# EAGLE design sideways (EAGLE 9.6.1)
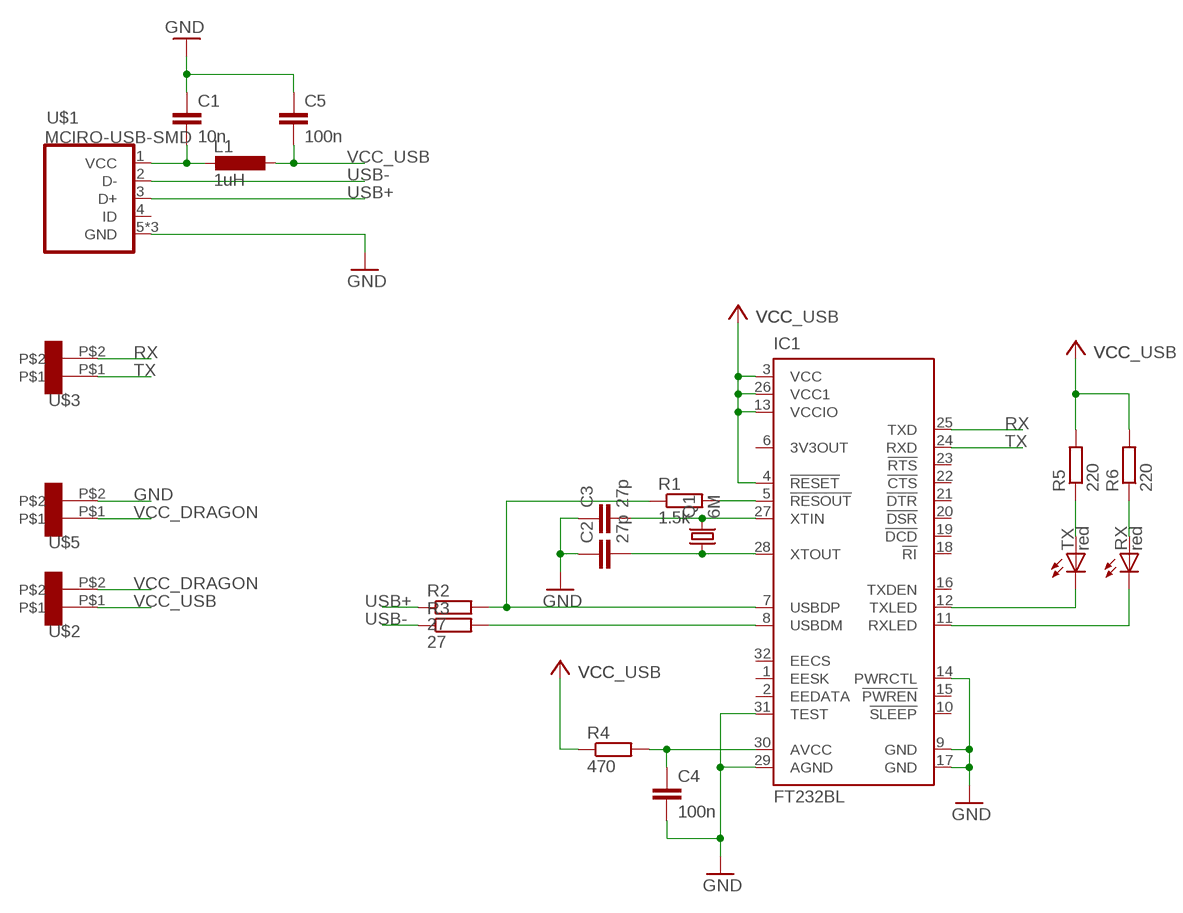
[diagram p0: schematic, sheet 1]

## Parts
C1  10n  C-EUC0603  [C0603]
C2  27p  C-EUC0603  [C0603]
C3  27p  C-EUC0603  [C0603]
C4  100n  C-EUC0603  [C0603]
C5  100n  C-EUC0603  [C0603]
IC1  FT232BL  [LQFP32-7X7]
L1  1uH  L-EUL0603  [L0603]
Q1  6M  CRYSTALHC49U-V  [HC49U-V]
R1  1.5k  R-EU_R0603  [R0603]
R2  27  R-EU_R0603  [R0603]
R3  27  R-EU_R0603  [R0603]
R4  470  R-EU_R0603  [R0603]
R5  220  R-EU_R0603  [R0603]
R6  220  R-EU_R0603  [R0603]
RX  red  LED_0603  [C0603]
TX  red  LED_0603  [C0603]
U$1  MCIRO-USB-SMD  [MICRO-USB-3]
U$2  CON_DIL_2  [CON_DIL_2]
U$3  CON_DIL_2  [CON_DIL_2]
U$5  CON_DIL_2  [CON_DIL_2]

## Nets
GND: C1.1 C2.1 C3.1 C4.2 C5.1 IC1.9(GND) IC1.14(PWRCTL) IC1.17(GND) IC1.29(AGND) IC1.31(TEST) U$1.5(GND) U$1.GND0(GND) U$1.GND1(GND) U$5.P$2
N$1: IC1.5(!RESOUT) R1.2
N$2: IC1.7(USBDP) R1.1 R2.2
N$3: IC1.8(USBDM) R3.2
N$4: C1.2 L1.2 U$1.1(VCC)
N$6: C3.2 IC1.27(XTIN) Q1.2
N$7: C2.2 IC1.28(XTOUT) Q1.1
N$9: IC1.12(TXLED) TX.N
N$10: R5.1 TX.P
N$11: C4.1 IC1.30(AVCC) R4.2
N$12: R6.1 RX.P
N$13: IC1.11(RXLED) RX.N
RX: IC1.25(TXD) U$3.P$2
TX: IC1.24(RXD) U$3.P$1
USB+: R2.1 U$1.3(D+)
USB-: R3.1 U$1.2(D-)
VCC_DRAGON: U$2.P$2 U$5.P$1
VCC_USB: C5.2 IC1.3(VCC) IC1.4(!RESET) IC1.13(VCCIO) IC1.26(VCC1) L1.1 R4.1 R5.2 R6.2 U$2.P$1 ; supply symbol labelled VCC
Unconnected: IC1.1(EESK) IC1.2(EEDATA) IC1.6(3V3OUT) IC1.10(!SLEEP) IC1.15(!PWREN) IC1.16(TXDEN) IC1.18(!RI) IC1.19(!DCD) IC1.20(!DSR) IC1.21(!DTR) IC1.22(!CTS) IC1.23(!RTS) IC1.32(EECS) U$1.4(ID)

## Library data of the parts
C1-C5 = rcl:C-EU: CAPACITOR, European symbol; SPICEPREFIX: C
IC1 = ftdichip:FT232B: USB to serial UART interface Source: DS_FT232BL_BQ.pdf; MF: FARNELL; MPN: FT232BL/TR; OC_FARNELL: unknown; OC_NEWARK: 38K1551
L1 = rcl-2:L-EU: INDUCTOR, European symbol
Q1 = crystal:CRYSTAL: CRYSTAL; OC_FARNELL: 1666969; OC_NEWARK: unknown
R1-R6 = rcl:R-EU_: RESISTOR, European symbol; SPICEPREFIX: R
RX TX = led:LED_0603
U$1 = microusb:MCIRO-USB-SMD
U$2 U$3 U$5 = connector:CON_DIL_2

## Board
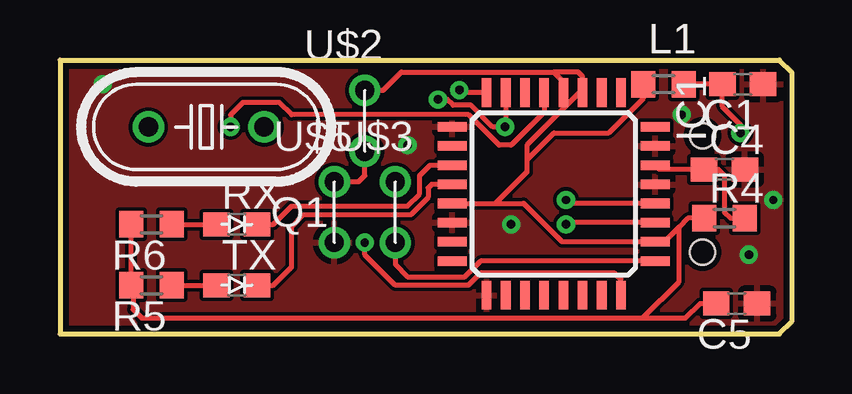
[diagram p1: board, top side]
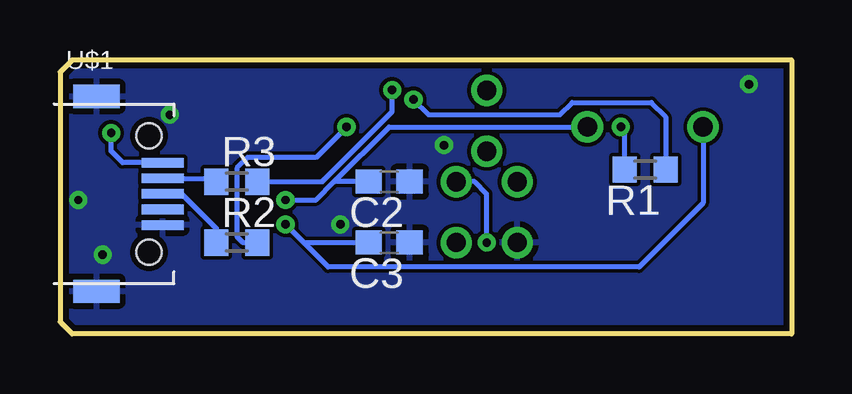
[diagram p2: board, bottom side, seen from below]

Size 30.48 x 11.43 mm. Coordinates in mm from the lower left corner, seen from the top.
Outline: 0,11.43 29.97,11.43 30.48,10.92 30.48,0.51 29.97,0 0,0 0,11.43
Copper layers (1*16): Top 0.035mm / dielectric 1.5mm / Bottom 0.035mm
Design rules "default *": minimum track width 6mil, minimum drill 0.35mm, track to track 6mil, track to pad 6mil, pad to pad 6mil, via to via 6mil, smd to smd 6mil, copper to edge 10mil, drill to drill 6mil, minimum pad ring 10mil, minimum via ring 8mil, stop-mask expansion 4mil, vias tented up to drill 0mil, thermal gap 10mil

### Footprints (pad centres in the part's own frame; a part is rotated, then mirrored left to right if it is on the bottom)
C0603 = smd 1.1 x 1: 1 -0.85,0; 2 0.85,0
LQFP32-7X7 = smd 1.2 x 0.4: 1 -4.225,2.8; 2 -4.225,2; 3 -4.225,1.2; 4 -4.225,0.4; 5 -4.225,-0.4; 6 -4.225,-1.2; 7 -4.225,-2; 8 -4.225,-2.8; 17 4.225,-2.8; 18 4.225,-2; 19 4.225,-1.2; 20 4.225,-0.4; 21 4.225,0.4; 22 4.225,1.2; 23 4.225,2; 24 4.225,2.8 | smd 0.4 x 1.2: 9 -2.8,-4.225; 10 -2,-4.225; 11 -1.2,-4.225; 12 -0.4,-4.225; 13 0.4,-4.225; 14 1.2,-4.225; 15 2,-4.225; 16 2.8,-4.225; 25 2.8,4.225; 26 2,4.225; 27 1.2,4.225; 28 0.4,4.225; 29 -0.4,4.225; 30 -1.2,4.225; 31 -2,4.225; 32 -2.8,4.225
L0603 = smd 1 x 1.1: 1 -0.85,0; 2 0.85,0
HC49U-V = drill 0.813: 1 -2.413,0; 2 2.413,0
R0603 = smd 1 x 1.1: 1 -0.85,0; 2 0.85,0
C0603' = smd 1.1 x 1: N 0.85,0; P -0.85,0
MICRO-USB-3 = smd 0.4 x 1.75: 1 -1.3,4.525; 2 -0.65,4.525; 3 0,4.525; 4 0.65,4.525; 5 1.3,4.525 | smd 0.965 x 1.93: GND0 4.064,1.778; GND1 -4.064,1.778 | hole 1.05: -2.425,3.968; 2.425,3.968
CON_DIL_2 = drill 0.8: P$1 0,2.54; P$2 0,0

### Placement (x,y rotation side)
C1  28.45,10.41 180 top
C2  16.76,6.35 180 bottom
C3  16.76,3.81 180 bottom
C4  27.69,6.86 0 top
C5  28.19,1.27 180 top
IC1  20.57,5.84 270 top
L1  25.15,10.41 0 top
Q1  6.1,8.64 180 top
R1  6.1,6.86 180 bottom
R2  23.11,3.81 0 bottom
R3  23.11,6.35 0 bottom
R4  27.69,4.83 0 top
R5  3.81,2.03 180 top
R6  3.81,4.57 180 top
RX  red  [C0603']  7.37,4.57 0 top
TX  red  [C0603']  7.37,2.03 0 top
U$1  30.73,5.84 270 bottom
U$2  12.7,7.62 0 top
U$3  13.97,3.81 0 top
U$5  11.43,3.81 0 top

### Tracks (layer width: path | path; a pad name or v marks a point on that pad's centre or on a via)
GND  (via drill 0.35)
  other vias: 1.78,10.41 29.72,5.59 28.7,3.3 18.8,4.57 25.91,9.14 14.48,7.87
  pour Bottom: 0,11.43 30.48,11.43 30.48,0 0,0
  pour Top: 0,11.43 30.48,11.43 30.48,0 0,0
N$1  (via drill 0.35)
  Top 0.203: IC1.5 20.17,9.25 18.8,7.87 18.29,7.87 17.02,9.14 9.65,9.14 9.14,9.65 7.62,9.65 7.11,9.14 v7.11,8.64
  Bottom 0.203: R1.2 6.95,8.47 v7.11,8.64
N$2  (via drill 0.35)
  Top 0.203: IC1.7 18.57,8.67 v18.54,8.64 18.03,8.64 17.13,9.54 16.38,9.54 16.14,9.78 v15.75,9.78
  Bottom 0.203: v18.54,8.64 19.81,7.37 22.66,7.37 23.11,6.91 23.11,4.06 22.86,3.81 R2.2 | v15.75,9.78 15.12,9.14 9.65,9.14 9.14,9.65 5.84,9.65 5.25,9.06 R1.1
N$3  (via drill 0.35)
  Top 0.203: IC1.8 16.75,10.07 v16.64,10.18
  Bottom 0.203: v16.64,10.18 16.64,9.26 19.55,6.35 R3.2
N$4  (via drill 0.35)
  Top 0.203: L1.2 C1.2 27.6,9.49 28.35,8.74 v28.35,8.38
  Bottom 0.203: U$1.1 27.87,7.14 28.35,7.62 v28.35,8.38
N$6  (via drill 0.35)
  Top 0.203: v21.08,4.57 21.15,4.64 IC1.27
  Bottom 0.203: Q1.2 3.68,5.46 6.35,2.79 19.3,2.79 20.32,3.81 | 20.32,3.81 v21.08,4.57 | 20.32,3.81 C3.2
N$7  (via drill 0.35)
  Top 0.203: IC1.28 21.23,5.44 v21.08,5.59
  Bottom 0.203: v21.08,5.59 19.81,5.59 19.05,6.35 | Q1.1 16.76,8.64 19.05,6.35 | C2.2 19.05,6.35
N$9
  Top 0.203: TX.N 8.89,2.03 9.65,2.79 9.65,4.47 10.16,4.98 14.62,4.98 15.34,5.7 15.34,6.1 15.49,6.24 IC1.12
N$10
  Top 0.203: R5.1 TX.P
N$11
  Top 0.203: R4.2 27.94,4.83 27.69,5.08 27.69,6.6 27.43,6.86 C4.1 24.98,6.86 IC1.30
N$12
  Top 0.203: R6.1 RX.P
N$13
  Top 0.203: RX.N 8.89,4.57 9.65,5.33 14.48,5.33 14.99,5.84 14.99,6.6 15.42,7.04 IC1.11
RX
  Top 0.203: IC1.25 17.52,3.04 16.87,2.39 14.48,2.39 13.97,2.9 U$3.P$2
TX  (via drill 0.35)
  Top 0.203: IC1.24 23.37,2.28 23.11,2.54 17.53,2.54 17.02,2.03 13.97,2.03 12.7,3.3 v12.7,3.81
  Bottom 0.203: U$3.P$1 13.21,6.35 12.7,5.84 v12.7,3.81
USB+
  Bottom 0.203: R2.1 23.96,4.41 25.4,5.84 U$1.3
USB-
  Bottom 0.203: U$1.2 24.11,6.49 R3.1
VCC_DRAGON
  Top 0.203: U$2.P$2 12.7,6.6 12.45,6.35 U$5.P$1
VCC_USB
  Top 0.203: R6.2 R5.2 3.05,1.94 3.05,1.02 3.4,0.66 24.28,0.66 | 25.78,4.45 25.18,3.84 IC1.26 20.92,3.84 19.32,5.44 18.14,5.44 | 25.78,4.45 25.78,2.16 24.28,0.66 | IC1.13 18.14,5.44 | 19.45,7.26 19.45,7.87 21.64,10.07 IC1.3 21.77,10.74 21.59,10.92 20.57,10.92 | 19.45,7.26 19.45,6.75 18.14,5.44 | R4.1 26.16,4.83 25.78,4.45 | 24.28,0.66 26.06,0.66 26.67,1.27 C5.2 | L1.1 24.3,9.82 22.86,8.38 20.57,8.38 19.45,7.26 | IC1.4 20.97,10.52 20.57,10.92 | U$2.P$1 13.46,10.16 14.22,10.92 20.57,10.92

### Text on the board
bDocument: VCC | VCC | RX | GND | TX